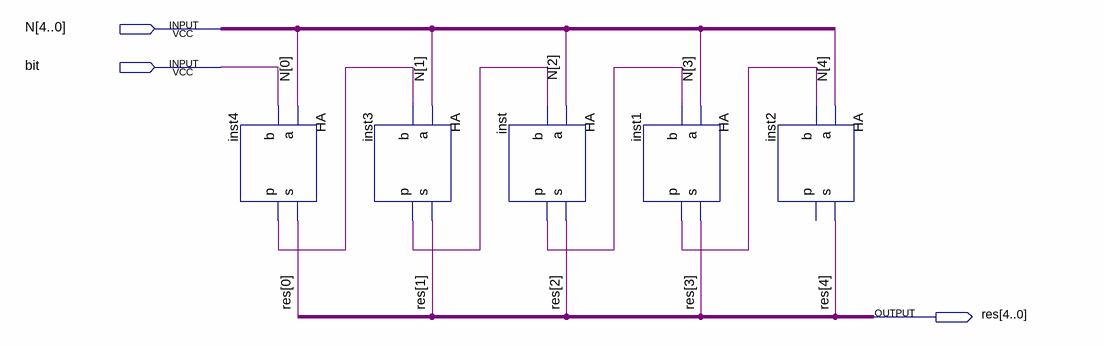
[diagram p0: schematic sheet]
// Quartus schematic BIT_ADD.bdf as structural Verilog: 5 symbols, 3 pins
module BIT_ADD (
  input  [4:0] N,
  input  \bit ,
  output [4:0] res
);

  wire inst1_p, inst3_p, inst4_p, inst_p;

  HA inst4 (.a(N[0]), .b(\bit ), .s(res[0]), .p(inst4_p));
  HA inst3 (.a(N[1]), .b(inst4_p), .s(res[1]), .p(inst3_p));
  HA inst (.a(N[2]), .b(inst3_p), .s(res[2]), .p(inst_p));
  HA inst1 (.a(N[3]), .b(inst_p), .s(res[3]), .p(inst1_p));
  HA inst2 (.a(N[4]), .b(inst1_p), .s(res[4]));  // open: p
endmodule
